# Altium schematic sheet [8] Conectors.SchDoc: =DocumentName
size A3; ENG_APP_DATE: --/--/--; DSN_APP_DATE: --/--/--; CHK_APP_DATE: --/--/--; Organization: ORGANIZATION; Address1: R. Aprígio Veloso, 882, Universitário; Address2: Campina Grande - PB; Address3: 58429-900; DocumentNumber: 8; Revision: -; SheetNumber: 8; SheetTotal: 9; ENG_DATE: --/--/--; DSN_DATE: --/--/--; CHK_DATE: --/--/--; SCH_SCALE: 1:1
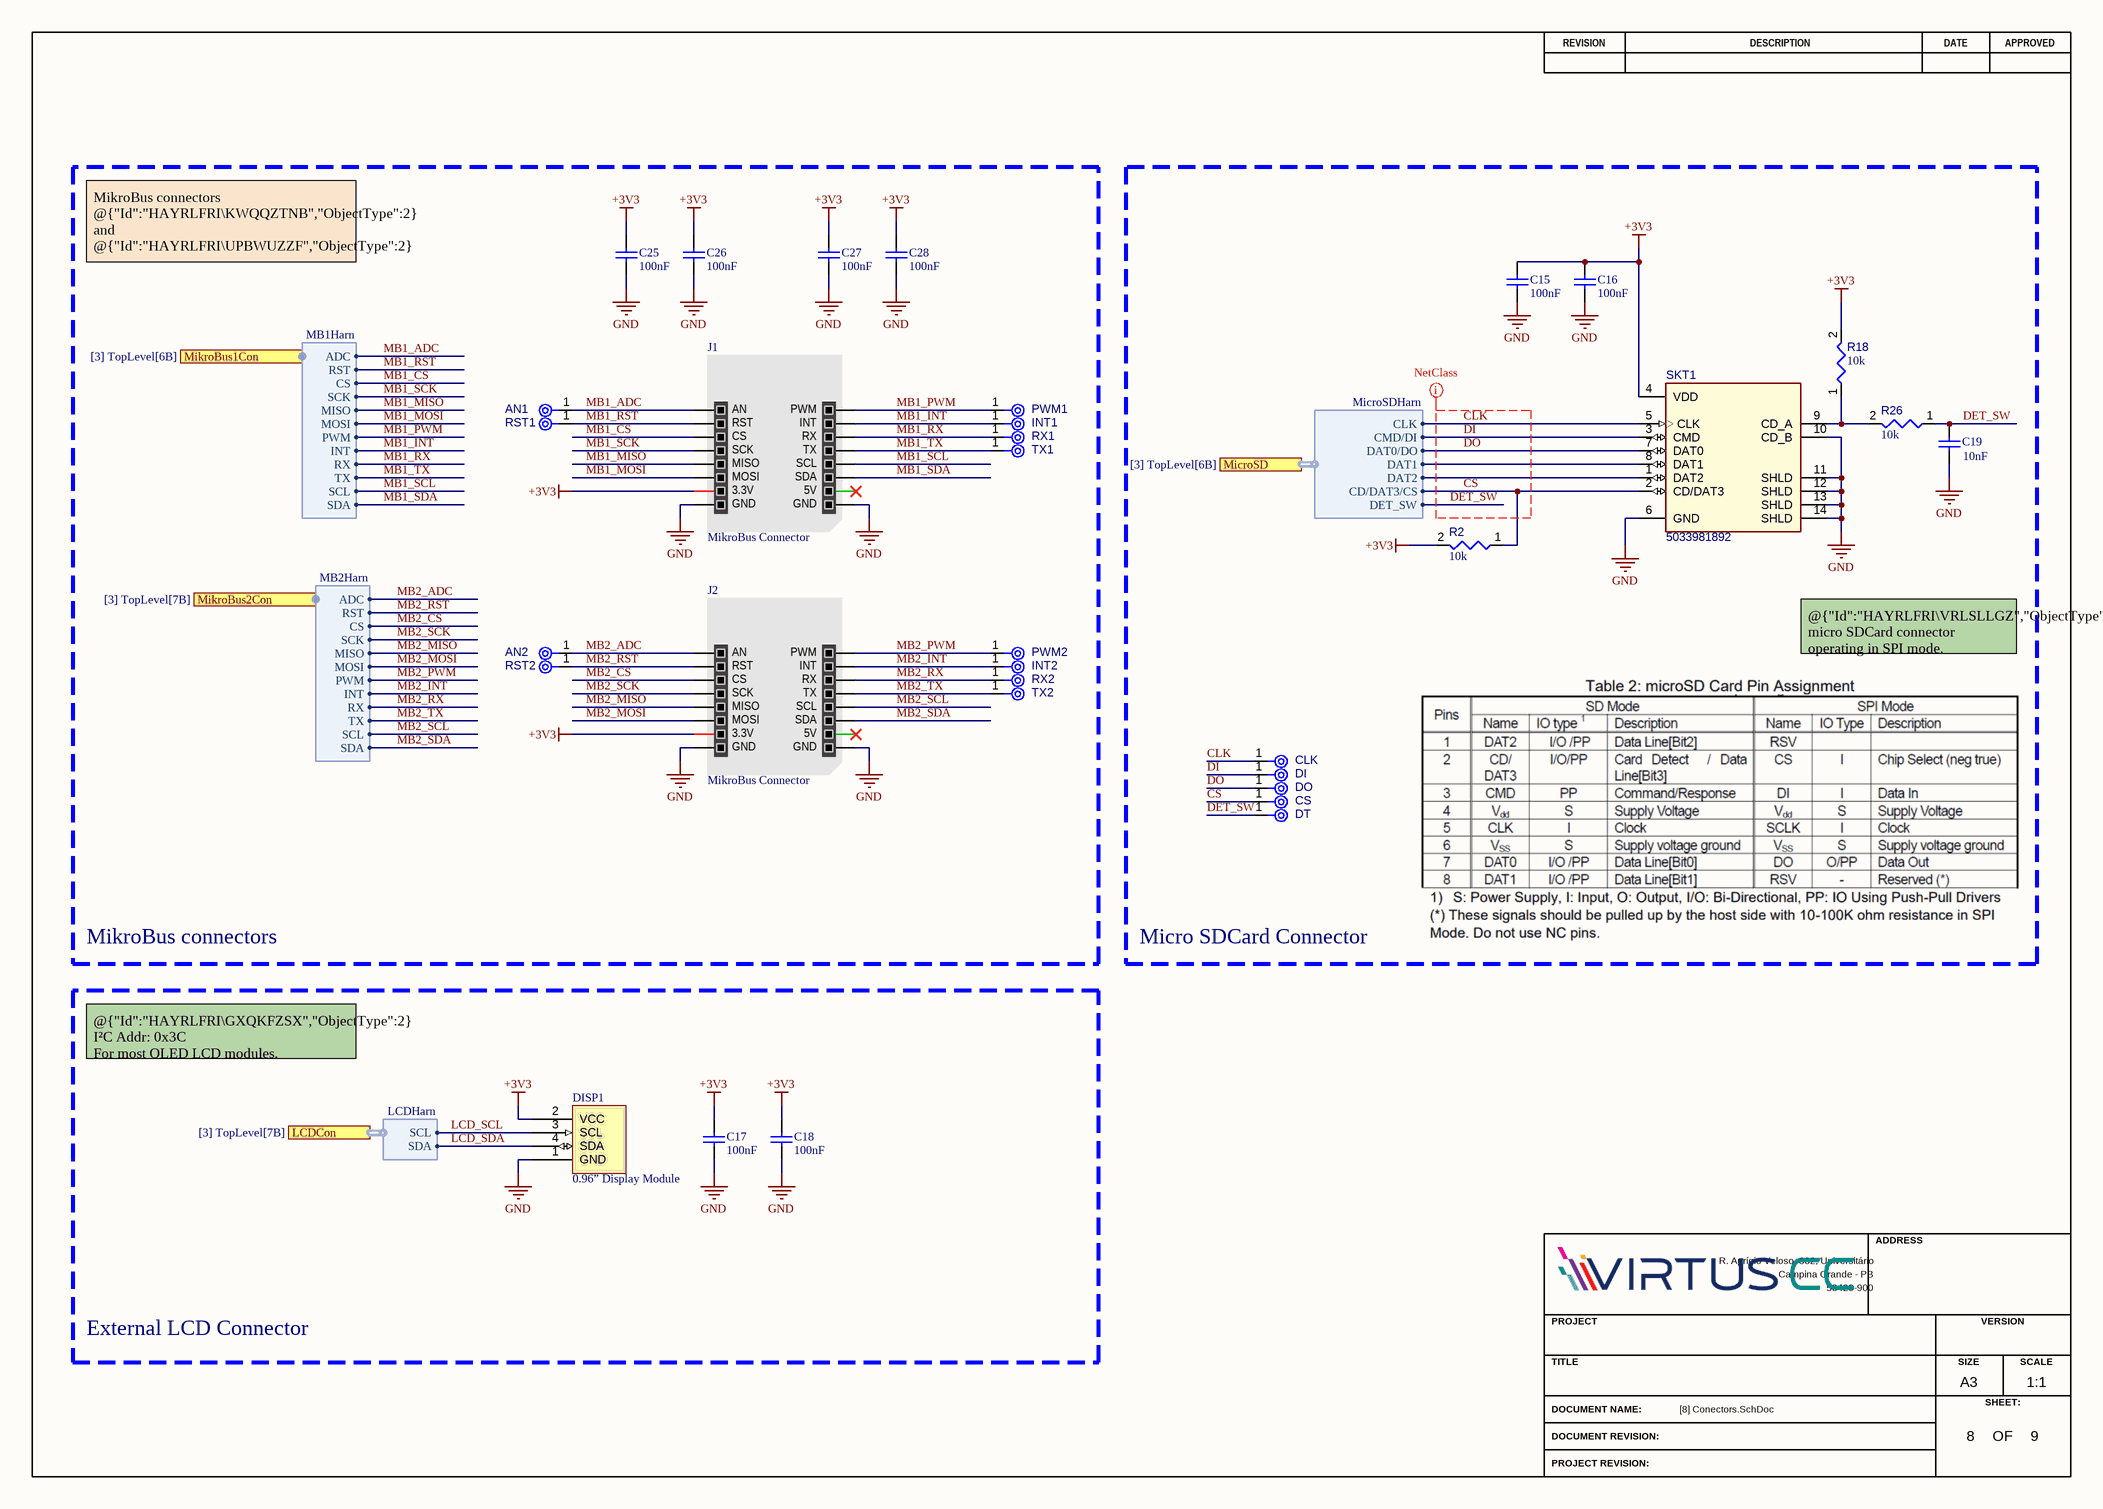
[diagram p0: [8] Conectors.SchDoc]

## Parts
AN1  TPAD6R  [TP06R]  (value not drawn)  (no BOM)
AN2  TPAD6R  [TP06R]  (value not drawn)  (no BOM)
C15  value 100nF  [CAPC0603(1608)100_L]  (hidden comment: VJ0603Y104MXJCW1BC)
C16  value 100nF  [CAPC0603(1608)100_L]  (hidden comment: VJ0603Y104MXJCW1BC)
C17  value 100nF  [CAPC0603(1608)100_L]  (hidden comment: VJ0603Y104MXJCW1BC)
C18  value 100nF  [CAPC0603(1608)100_L]  (hidden comment: VJ0603Y104MXJCW1BC)
C19  value 10nF  [CAPC0603(1608)100_L]  (hidden comment: VJ0603Y103KXAAC)
C25  value 100nF  [CAPC0603(1608)100_L]  (hidden comment: VJ0603Y104MXJCW1BC)
C26  value 100nF  [CAPC0603(1608)100_L]  (hidden comment: VJ0603Y104MXJCW1BC)
C27  value 100nF  [CAPC0603(1608)100_L]  (hidden comment: VJ0603Y104MXJCW1BC)
C28  value 100nF  [CAPC0603(1608)100_L]  (hidden comment: VJ0603Y104MXJCW1BC)
CLK  TPAD6R  [TP06R]  (value not drawn)  (no BOM)
CS  TPAD6R  [TP06R]  (value not drawn)  (no BOM)
DI  TPAD6R  [TP06R]  (value not drawn)  (no BOM)
DISP1  0.96” Display Module  [New footprint 1]
DO  TPAD6R  [TP06R]  (value not drawn)  (no BOM)
DT  TPAD6R  [TP06R]  (value not drawn)  (no BOM)
INT1  TPAD6R  [TP06R]  (value not drawn)  (no BOM)
INT2  TPAD6R  [TP06R]  (value not drawn)  (no BOM)
J1  MikroBus Connector  [New footprint 1]  (no BOM)
J2  MikroBus Connector  [New footprint 1]  (no BOM)
PWM1  TPAD6R  [TP06R]  (value not drawn)  (no BOM)
PWM2  TPAD6R  [TP06R]  (value not drawn)  (no BOM)
R2  value 10k  [RESC0603(1608)_L]  (hidden comment: Resistor 10k +/-1% 0603 100 mW)
R18  value 10k  [RESC0603(1608)_L]  (hidden comment: Resistor 10k +/-1% 0603 100 mW)
R26  value 10k  [RESC0603(1608)_L]  (hidden comment: Resistor 10k +/-1% 0603 100 mW)
RST1  TPAD6R  [TP06R]  (value not drawn)  (no BOM)
RST2  TPAD6R  [TP06R]  (value not drawn)  (no BOM)
RX1  TPAD6R  [TP06R]  (value not drawn)  (no BOM)
RX2  TPAD6R  [TP06R]  (value not drawn)  (no BOM)
SKT1  5033981892  [MOLX-5033981892_V]
TX1  TPAD6R  [TP06R]  (value not drawn)  (no BOM)
TX2  TPAD6R  [TP06R]  (value not drawn)  (no BOM)

## Blocks framed on the sheet
MikroBus connectors: AN1 AN2 C25-C28 INT1 INT2 J1 J2 PWM1 PWM2 RST1 RST2 RX1 RX2 TX1 TX2
Micro SDCard Connector: C15 C16 C19 CLK CS DI DO DT R2 R18 R26 SKT1
External LCD Connector: C17 C18 DISP1

## Ports
LCDCon (harness LCDHarn, see [3] TopLevel[7B]), MicroSD (harness MicroSDHarn, see [3] TopLevel[6B]), MikroBus1Con (harness MB1Harn, see [3] TopLevel[6B]), MikroBus2Con (harness MB2Harn, see [3] TopLevel[7B])

## Harnesses
MicroSDHarn: CLK, CMD/DI, DAT0/DO, CD/DAT3/CS, DAT1, DAT2, DET_SW
LCDHarn: SCL, SDA
MB1Harn: ADC, RST, CS, SCK, MISO, MOSI, PWM, INT, RX, TX, SCL, SDA
MB2Harn: ADC, RST, CS, SCK, MISO, MOSI, PWM, INT, RX, TX, SCL, SDA

## Nets
+3V3: C15.1 C16.1 C17.1 C18.1 C25.1 C26.1 C27.1 C28.1 DISP1.2(VCC) J1.7(3.3V) J2.7(3.3V) R2.2 R18.2 SKT1.4(VDD)
GND: C15.2 C16.2 C17.2 C18.2 C19.1 C25.2 C26.2 C27.2 C28.2 DISP1.1(GND) J1.8(GND) J1.9(GND) J2.8(GND) J2.9(GND) SKT1.6(GND) SKT1.10(CD_B) SKT1.11(SHLD) SKT1.12(SHLD) SKT1.13(SHLD) SKT1.14(SHLD)
CLK: CLK.1(TP) SKT1.5(CLK) ; port MicroSD.CLK
CS: CS.1(TP) R2.1 SKT1.2(CD/DAT3) ; port MicroSD.CD/DAT3/CS
DET_SW: C19.2 DT.1(TP) R26.1 ; port MicroSD.DET_SW
DI: DI.1(TP) SKT1.3(CMD) ; port MicroSD.CMD/DI
DO: DO.1(TP) SKT1.7(DAT0) ; port MicroSD.DAT0/DO
LCD_SCL: DISP1.3(SCL) ; port LCDCon.SCL
LCD_SDA: DISP1.4(SDA) ; port LCDCon.SDA
MB1_ADC: AN1.1(TP) J1.1(AN) ; port MikroBus1Con.ADC
MB1_CS: J1.3(CS) ; port MikroBus1Con.CS
MB1_INT: INT1.1(TP) J1.15(INT) ; port MikroBus1Con.INT
MB1_MISO: J1.5(MISO) ; port MikroBus1Con.MISO
MB1_MOSI: J1.6(MOSI) ; port MikroBus1Con.MOSI
MB1_PWM: J1.16(PWM) PWM1.1(TP) ; port MikroBus1Con.PWM
MB1_RST: J1.2(RST) RST1.1(TP) ; port MikroBus1Con.RST
MB1_RX: J1.14(RX) RX1.1(TP) ; port MikroBus1Con.RX
MB1_SCK: J1.4(SCK) ; port MikroBus1Con.SCK
MB1_SCL: J1.12(SCL) ; port MikroBus1Con.SCL
MB1_SDA: J1.11(SDA) ; port MikroBus1Con.SDA
MB1_TX: J1.13(TX) TX1.1(TP) ; port MikroBus1Con.TX
MB2_ADC: AN2.1(TP) J2.1(AN) ; port MikroBus2Con.ADC
MB2_CS: J2.3(CS) ; port MikroBus2Con.CS
MB2_INT: INT2.1(TP) J2.15(INT) ; port MikroBus2Con.INT
MB2_MISO: J2.5(MISO) ; port MikroBus2Con.MISO
MB2_MOSI: J2.6(MOSI) ; port MikroBus2Con.MOSI
MB2_PWM: J2.16(PWM) PWM2.1(TP) ; port MikroBus2Con.PWM
MB2_RST: J2.2(RST) RST2.1(TP) ; port MikroBus2Con.RST
MB2_RX: J2.14(RX) RX2.1(TP) ; port MikroBus2Con.RX
MB2_SCK: J2.4(SCK) ; port MikroBus2Con.SCK
MB2_SCL: J2.12(SCL) ; port MikroBus2Con.SCL
MB2_SDA: J2.11(SDA) ; port MikroBus2Con.SDA
MB2_TX: J2.13(TX) TX2.1(TP) ; port MikroBus2Con.TX
NetR18_1: R18.1 R26.2 SKT1.9(CD_A)
NetSKT1_1: SKT1.1(DAT2) ; port MicroSD.DAT2
NetSKT1_8: SKT1.8(DAT1) ; port MicroSD.DAT1

Not connected (* = marked no-connect by the designer): J1 10(5V)*; J2 10(5V)*

## Layout directives
net class SDCard: CLK, CS, DET_SW, DI, DO

## Notes on the sheet
- MikroBus connectors @{"Id":"HAYRLFRI\KWQQZTNB","ObjectType":2} and @{"Id":"HAYRLFRI\UPBWUZZF","ObjectType":2} only compatible with modules operating in 3.3V. 5V power supply pin is floating.
- @{"Id":"HAYRLFRI\VRLSLLGZ","ObjectType":2} micro SDCard connector operating in SPI mode.
- @{"Id":"HAYRLFRI\GXQKFZSX","ObjectType":2} I²C Addr: 0x3C
  For most OLED LCD modules.
- REVISION
- DESCRIPTION
- DATE
- APPROVED
- ADDRESS
- PROJECT
- VERSION
- TITLE
- A3
- SIZE
- SCALE
- DOCUMENT NAME:
- DOCUMENT REVISION:
- OF
- SHEET:
- PROJECT REVISION:

## Library data of the parts
AN1 AN2 CLK CS DI DO DT INT1 INT2 PWM1 PWM2 RST1 RST2 RX1 RX2 TX1 TX2 = CMP-00028-00002-2: 0.6mm round; Pins: 1
C15-C18 C25-C28 = CMP-001-00085-1: Multilayer Ceramic Capacitor, 0.1 uF, 16 V, ± 20%, X7R, 0603 [1608 Metric]; Dielectric Material: Tantalum; Voltage Rating: 16V; Packaging: Tape and Reel; Min Operating Temperature: -55°C; Case/Package: 0603; Length: 1.6mm; Termination: SMD/SMT; Height: 0.95mm; Mounting Technology: Surface Mount; Width: 0.8mm; Case Code (Imperial): 0603; Construction: Flat; Lead Free: Lead Free; Package Quantity: 4000; Max Operating Temperature: 125°C; Dielectric: X7R; RoHS Compliant: Yes; Depth: 0.8mm; Tolerance: 20%; Series: VJ; Case Code (Metric): 1608; Voltage Rating (DC): 16V
C19 = CMP-001-00084-1: Multilayer Ceramic Capacitor, 0.01 uF, 50 V, ± 10%, X7R, 0603 [1608 Metric]; Voltage Rating: 50V; Height: 0.92mm; Voltage Rating (DC): 50V; Depth: 0.8mm; Case Code (Imperial): 0603; Packaging: Tape and Reel; Length: 1.6mm; Max Operating Temperature: 125°C; Min Operating Temperature: -55°C; Case/Package: 0603; Pins: 2; Series: VJ; Thickness: 0.036inch; Weight: 7.1E-05oz; Reach SVHC Compliant: Unknown; Termination: SMD/SMT; Package Quantity: 1; RoHS Compliant: Yes; Mounting Technology: Surface Mount; Construction: Flat; Voltage: 50V; Lead Free: Lead Free; Width: 0.031inch; Case Code (Metric): 1608; Tolerance: 10%; Dielectric: X7R
DISP1 = CMP-003-00030-5: 0.96 Inch I2C OLED Display Module
J1 J2 = CMP-002-00071-3: MikroBus shield pico
R2 R18 R26 = CMP-009-00017-7: Chip Resistor, 10 KOhm, +/- 1%, 01 W, -55 to 155 degC, 0603 (1608 Metric); Voltage Rating: 50V; Power: 100mW; RoHS Compliant: True; Min Operating Temperature: -55°C; Pins: 2; Case/Package: 0603; Mounting Technology: SM; Max Operating Temperature: 155°C; Tolerance: 1%
SKT1 = CMP-002-00049-5: Micro SD Card Connector, Pitch 1.1 mm, 8 Position, Height 1.4 mm, -25 to 85 degC, RoHS, Tape and Reel; Pins: 14